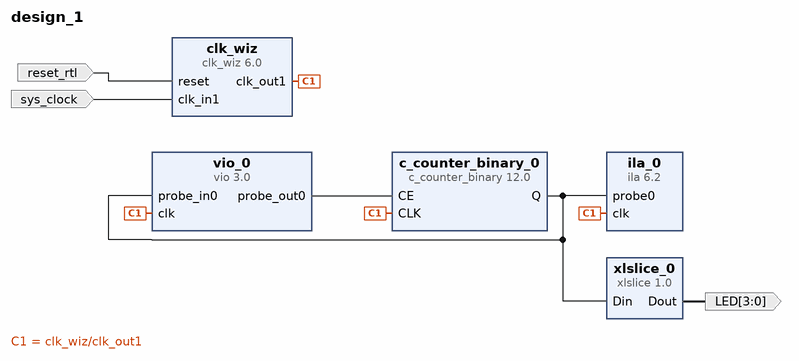
[diagram p0: block diagram of the top level]
# Vivado block design design_1, xc7z020clg400-1, Vivado 2021.2
create_bd_design design_1

create_bd_port -dir I -type clk sys_clock
set_property -dict {CONFIG.FREQ_HZ 125000000 CONFIG.PHASE 0.0} [get_bd_ports sys_clock]
create_bd_port -dir I -type rst reset_rtl
set_property -dict {CONFIG.POLARITY ACTIVE_HIGH} [get_bd_ports reset_rtl]
create_bd_port -dir O -from 3 -to 0 LED

create_bd_cell -type ip -vlnv xilinx.com:ip:c_counter_binary:12.0 c_counter_binary_0
set_property -dict {CONFIG.CE true CONFIG.Output_Width 32} [get_bd_cells c_counter_binary_0]
create_bd_cell -type ip -vlnv xilinx.com:ip:ila:6.2 ila_0
set_property -dict [list \
  CONFIG.C_ENABLE_ILA_AXI_MON false \
  CONFIG.C_MONITOR_TYPE Native \
  CONFIG.C_NUM_OF_PROBES 1 \
  CONFIG.C_PROBE0_WIDTH 32 \
] [get_bd_cells ila_0]
create_bd_cell -type ip -vlnv xilinx.com:ip:vio:3.0 vio_0
create_bd_cell -type ip -vlnv xilinx.com:ip:clk_wiz:6.0 clk_wiz
set_property -dict {CONFIG.CLK_IN1_BOARD_INTERFACE sys_clock CONFIG.USE_BOARD_FLOW true} [get_bd_cells clk_wiz]
create_bd_cell -type ip -vlnv xilinx.com:ip:xlslice:1.0 xlslice_0
set_property -dict {CONFIG.DIN_FROM 26 CONFIG.DIN_TO 23 CONFIG.DOUT_WIDTH 4} [get_bd_cells xlslice_0]

# ---- connections ----

connect_bd_net [get_bd_pins clk_wiz/clk_out1] [get_bd_pins c_counter_binary_0/CLK] [get_bd_pins ila_0/clk] [get_bd_pins vio_0/clk]
connect_bd_net [get_bd_pins c_counter_binary_0/Q] [get_bd_pins ila_0/probe0] [get_bd_pins vio_0/probe_in0] [get_bd_pins xlslice_0/Din]
connect_bd_net [get_bd_ports reset_rtl] [get_bd_pins clk_wiz/reset]
connect_bd_net [get_bd_ports sys_clock] [get_bd_pins clk_wiz/clk_in1]
connect_bd_net [get_bd_pins vio_0/probe_out0] [get_bd_pins c_counter_binary_0/CE]
connect_bd_net [get_bd_pins xlslice_0/Dout] [get_bd_ports LED]

validate_bd_design
save_bd_design
